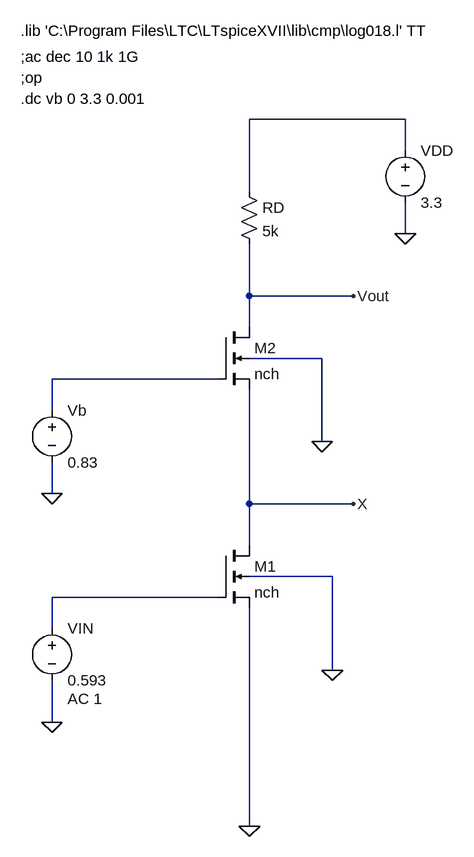
[diagram p0: schematic cascode.asc]
cascode.asc, the LTspice schematic file:
Version 4
SHEET 1 880 1220
WIRE 448 112 208 112
WIRE 448 160 448 112
WIRE 208 224 208 112
WIRE 448 288 448 240
WIRE 208 384 208 304
WIRE 368 384 208 384
WIRE 208 432 208 384
WIRE 320 480 208 480
WIRE 160 512 -96 512
WIRE -96 560 -96 512
WIRE 320 608 320 480
WIRE -96 688 -96 640
WIRE 208 704 208 528
WIRE 368 704 208 704
WIRE 208 768 208 704
WIRE 336 816 208 816
WIRE 160 848 -96 848
WIRE -96 896 -96 848
WIRE 336 960 336 816
WIRE -96 1040 -96 976
WIRE 208 1200 208 864
FLAG 448 288 0
FLAG 368 384 Vout
FLAG 208 1200 0
FLAG -96 688 0
FLAG 320 608 0
FLAG 336 960 0
FLAG -96 1040 0
FLAG 368 704 X
SYMBOL nmos4 160 768 R0
SYMATTR InstName M1
SYMATTR Value nch
SYMATTR Value2 l=0.36u w=36u
SYMBOL voltage 448 144 R0
WINDOW 123 0 0 Left 0
WINDOW 39 0 0 Left 0
SYMATTR InstName VDD
SYMATTR Value 3.3
SYMBOL voltage -96 880 R0
WINDOW 123 24 124 Left 2
WINDOW 39 0 0 Left 0
SYMATTR Value2 AC 1
SYMATTR InstName VIN
SYMATTR Value 0.593
SYMBOL voltage -96 544 R0
WINDOW 123 0 0 Left 0
WINDOW 39 0 0 Left 0
SYMATTR InstName Vb
SYMATTR Value 0.83
SYMBOL res 192 208 R0
SYMATTR InstName RD
SYMATTR Value 5k
SYMBOL nmos4 160 432 R0
SYMATTR InstName M2
SYMATTR Value nch
SYMATTR Value2 l=0.18u w=18u
TEXT -144 -24 Left 2 !.lib 'C:\\Program Files\\LTC\\LTspiceXVII\\lib\\cmp\\log018.l' TT
TEXT -144 16 Left 2 !;ac dec 10 1k 1G
TEXT -144 48 Left 2 !;op
TEXT -144 80 Left 2 !.dc vb 0 3.3 0.001

The netlist it stands for:
* cascode.asc
M1 X N003 0 0 nch l=0.36u w=36u
VDD N001 0 3.3
VIN N003 0 0.593 AC 1
Vb N002 0 0.83
RD N001 Vout 5k
M2 Vout N002 X 0 nch l=0.18u w=18u
.model NMOS NMOS
.model PMOS PMOS
.lib standard.mos
.lib 'C:\Program Files\LTC\LTspiceXVII\lib\cmp\log018.l' TT
;ac dec 10 1k 1G
;op
.dc vb 0 3.3 0.001
.backanno
.end

* Results of the author's LTspice run, read from the files saved beside the schematic
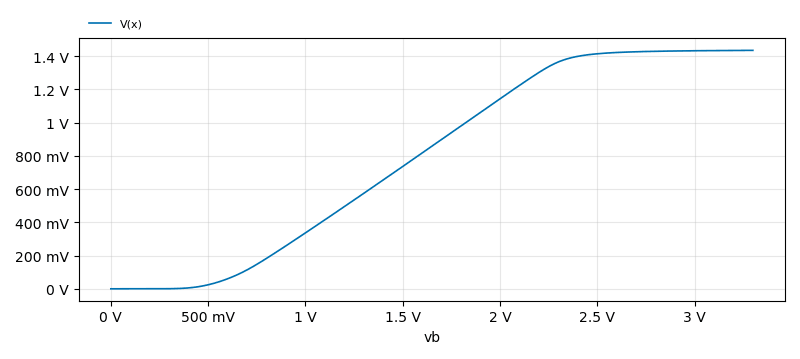
[diagram p1: DC transfer characteristic of cascode.asc, plotted from the saved traces]
* DC transfer characteristic, 1 run:
*   V(x): 119.4 nV at vb=0 V, 1.436 V at vb=3.3 V, min 119.4 nV, max 1.436 V